# Altium schematic sheet RGBM-05.SchDoc
size Tabloid; SheetNumber: 5; SheetTotal: 7
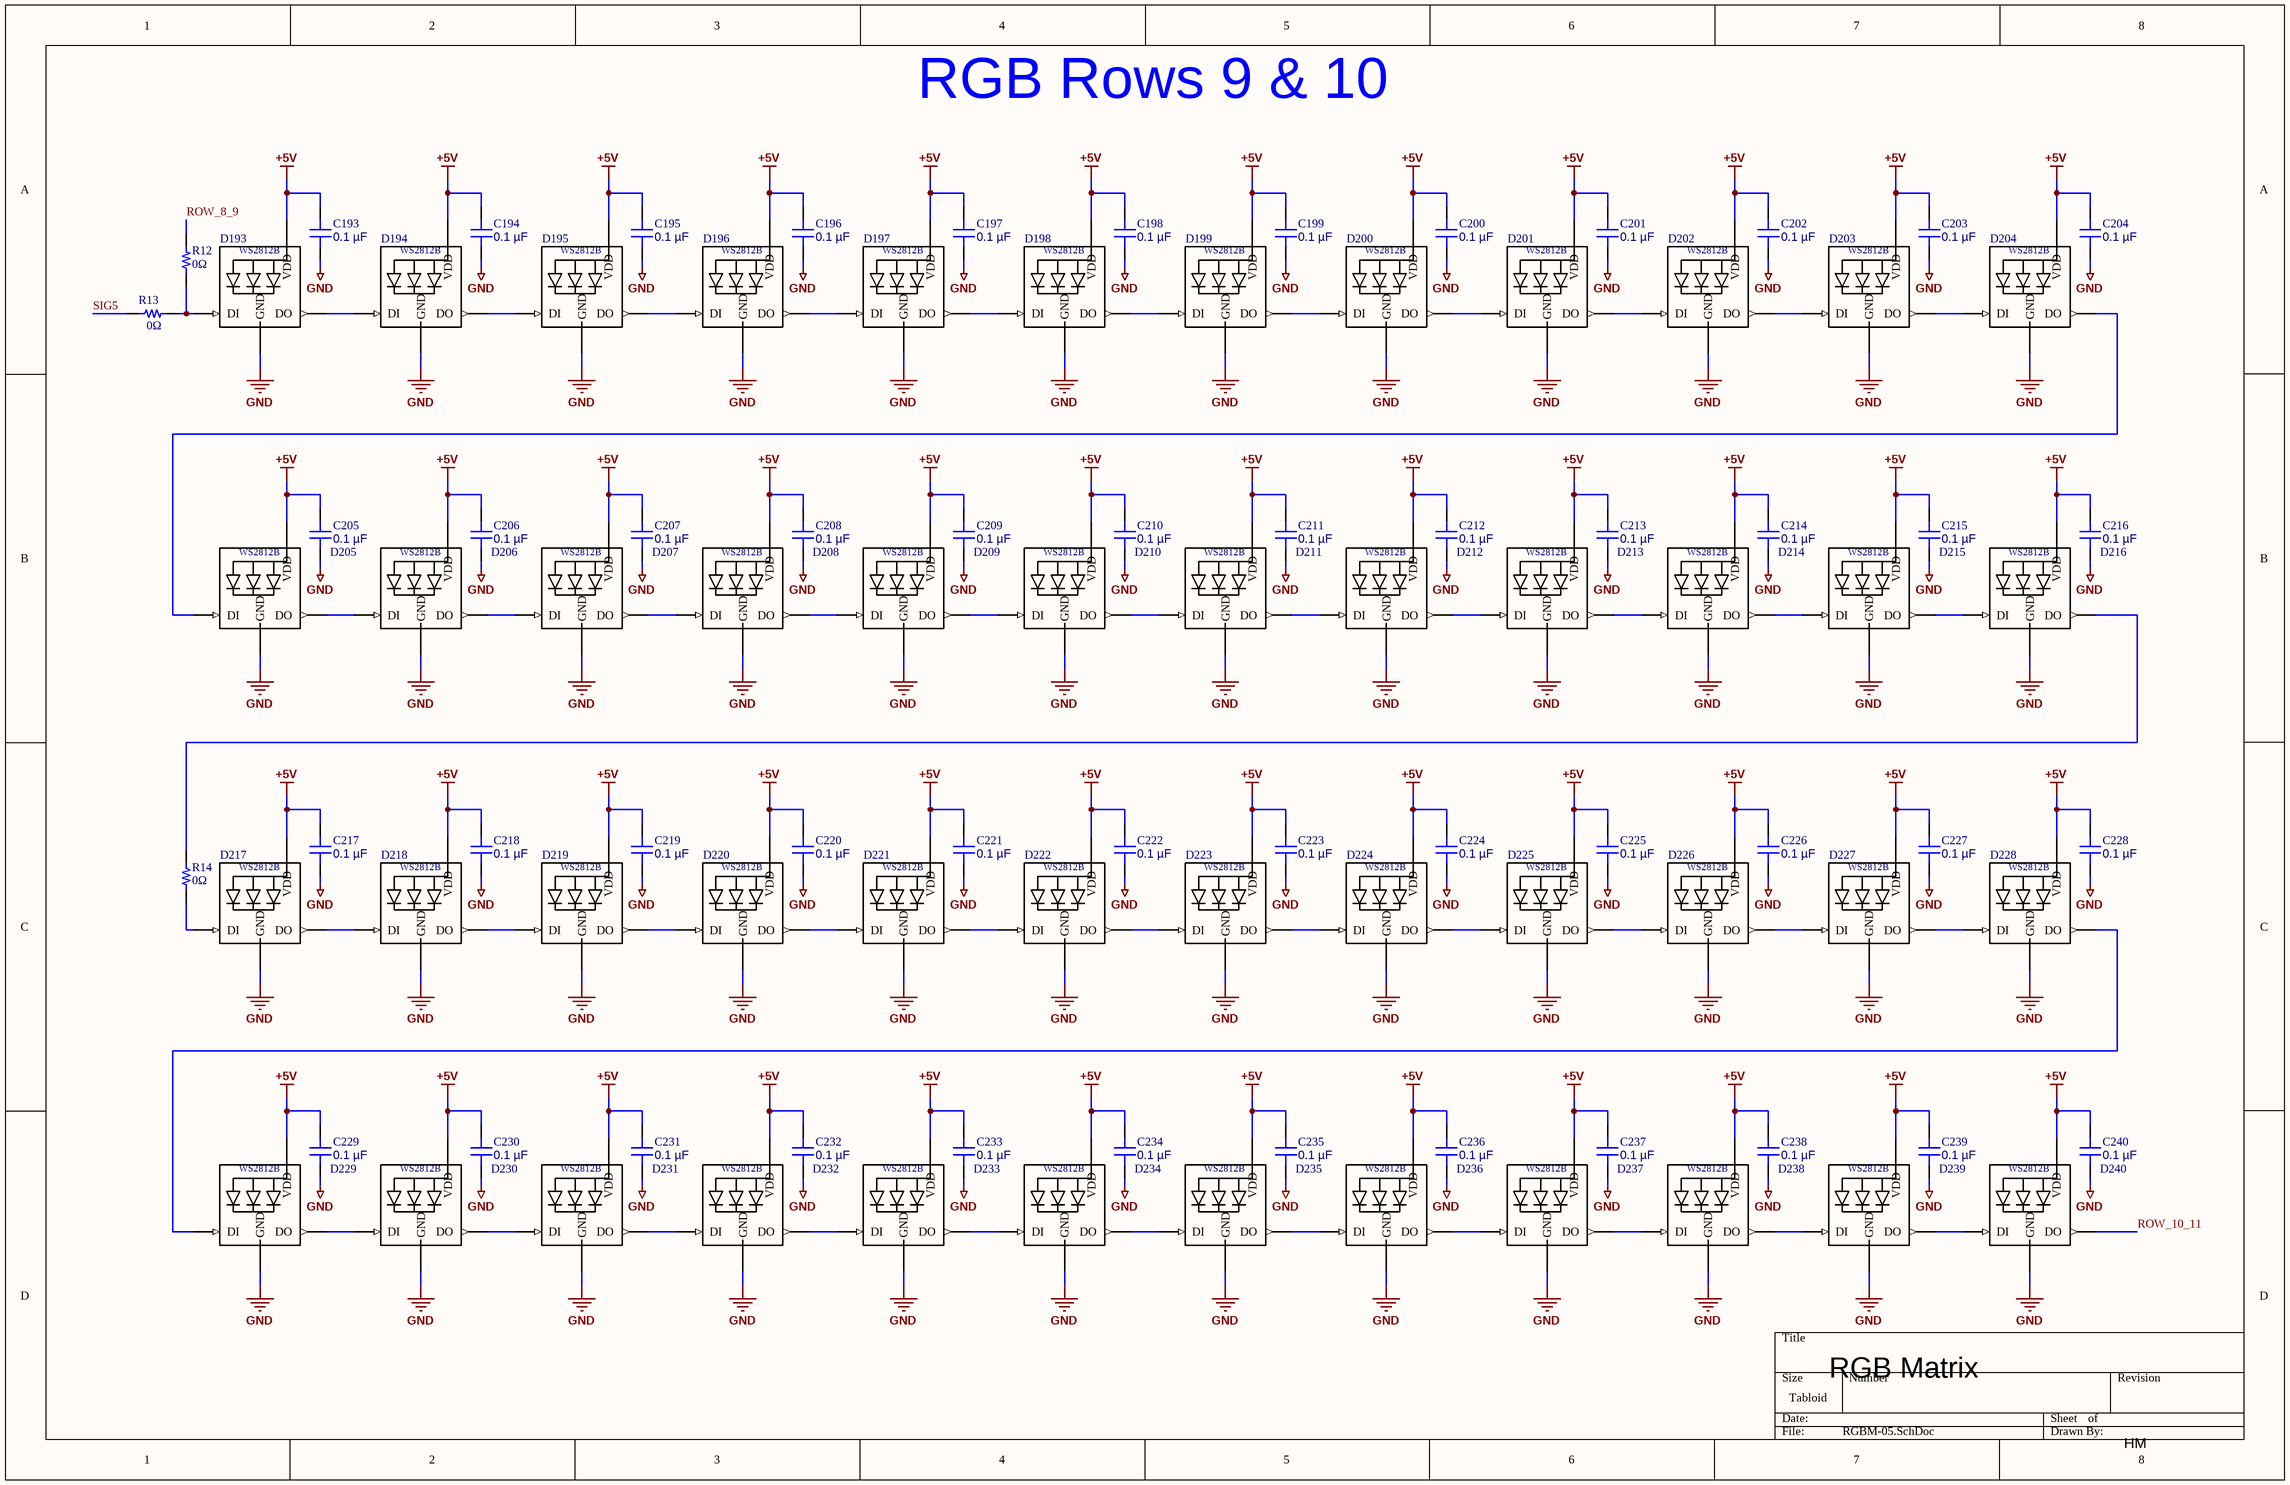
[diagram p0: RGBM-05.SchDoc]

## Parts
C193  0.1 µF  [CAP 0603_1608]
C194  0.1 µF  [CAP 0603_1608]
C195  0.1 µF  [CAP 0603_1608]
C196  0.1 µF  [CAP 0603_1608]
C197  0.1 µF  [CAP 0603_1608]
C198  0.1 µF  [CAP 0603_1608]
C199  0.1 µF  [CAP 0603_1608]
C200  0.1 µF  [CAP 0603_1608]
C201  0.1 µF  [CAP 0603_1608]
C202  0.1 µF  [CAP 0603_1608]
C203  0.1 µF  [CAP 0603_1608]
C204  0.1 µF  [CAP 0603_1608]
C205  0.1 µF  [CAP 0603_1608]
C206  0.1 µF  [CAP 0603_1608]
C207  0.1 µF  [CAP 0603_1608]
C208  0.1 µF  [CAP 0603_1608]
C209  0.1 µF  [CAP 0603_1608]
C210  0.1 µF  [CAP 0603_1608]
C211  0.1 µF  [CAP 0603_1608]
C212  0.1 µF  [CAP 0603_1608]
C213  0.1 µF  [CAP 0603_1608]
C214  0.1 µF  [CAP 0603_1608]
C215  0.1 µF  [CAP 0603_1608]
C216  0.1 µF  [CAP 0603_1608]
C217  0.1 µF  [CAP 0603_1608]
C218  0.1 µF  [CAP 0603_1608]
C219  0.1 µF  [CAP 0603_1608]
C220  0.1 µF  [CAP 0603_1608]
C221  0.1 µF  [CAP 0603_1608]
C222  0.1 µF  [CAP 0603_1608]
C223  0.1 µF  [CAP 0603_1608]
C224  0.1 µF  [CAP 0603_1608]
C225  0.1 µF  [CAP 0603_1608]
C226  0.1 µF  [CAP 0603_1608]
C227  0.1 µF  [CAP 0603_1608]
C228  0.1 µF  [CAP 0603_1608]
C229  0.1 µF  [CAP 0603_1608]
C230  0.1 µF  [CAP 0603_1608]
C231  0.1 µF  [CAP 0603_1608]
C232  0.1 µF  [CAP 0603_1608]
C233  0.1 µF  [CAP 0603_1608]
C234  0.1 µF  [CAP 0603_1608]
C235  0.1 µF  [CAP 0603_1608]
C236  0.1 µF  [CAP 0603_1608]
C237  0.1 µF  [CAP 0603_1608]
C238  0.1 µF  [CAP 0603_1608]
C239  0.1 µF  [CAP 0603_1608]
C240  0.1 µF  [CAP 0603_1608]
D193  WS2812B  [*WS2812B_WS2812B(Primary)]  (value not drawn)
D194  WS2812B  [*WS2812B_WS2812B(Primary)]  (value not drawn)
D195  WS2812B  [*WS2812B_WS2812B(Primary)]  (value not drawn)
D196  WS2812B  [*WS2812B_WS2812B(Primary)]  (value not drawn)
D197  WS2812B  [*WS2812B_WS2812B(Primary)]  (value not drawn)
D198  WS2812B  [*WS2812B_WS2812B(Primary)]  (value not drawn)
D199  WS2812B  [*WS2812B_WS2812B(Primary)]  (value not drawn)
D200  WS2812B  [*WS2812B_WS2812B(Primary)]  (value not drawn)
D201  WS2812B  [*WS2812B_WS2812B(Primary)]  (value not drawn)
D202  WS2812B  [*WS2812B_WS2812B(Primary)]  (value not drawn)
D203  WS2812B  [*WS2812B_WS2812B(Primary)]  (value not drawn)
D204  WS2812B  [*WS2812B_WS2812B(Primary)]  (value not drawn)
D205  WS2812B  [*WS2812B_WS2812B(Primary)]  (value not drawn)
D206  WS2812B  [*WS2812B_WS2812B(Primary)]  (value not drawn)
D207  WS2812B  [*WS2812B_WS2812B(Primary)]  (value not drawn)
D208  WS2812B  [*WS2812B_WS2812B(Primary)]  (value not drawn)
D209  WS2812B  [*WS2812B_WS2812B(Primary)]  (value not drawn)
D210  WS2812B  [*WS2812B_WS2812B(Primary)]  (value not drawn)
D211  WS2812B  [*WS2812B_WS2812B(Primary)]  (value not drawn)
D212  WS2812B  [*WS2812B_WS2812B(Primary)]  (value not drawn)
D213  WS2812B  [*WS2812B_WS2812B(Primary)]  (value not drawn)
D214  WS2812B  [*WS2812B_WS2812B(Primary)]  (value not drawn)
D215  WS2812B  [*WS2812B_WS2812B(Primary)]  (value not drawn)
D216  WS2812B  [*WS2812B_WS2812B(Primary)]  (value not drawn)
D217  WS2812B  [*WS2812B_WS2812B(Primary)]  (value not drawn)
D218  WS2812B  [*WS2812B_WS2812B(Primary)]  (value not drawn)
D219  WS2812B  [*WS2812B_WS2812B(Primary)]  (value not drawn)
D220  WS2812B  [*WS2812B_WS2812B(Primary)]  (value not drawn)
D221  WS2812B  [*WS2812B_WS2812B(Primary)]  (value not drawn)
D222  WS2812B  [*WS2812B_WS2812B(Primary)]  (value not drawn)
D223  WS2812B  [*WS2812B_WS2812B(Primary)]  (value not drawn)
D224  WS2812B  [*WS2812B_WS2812B(Primary)]  (value not drawn)
D225  WS2812B  [*WS2812B_WS2812B(Primary)]  (value not drawn)
D226  WS2812B  [*WS2812B_WS2812B(Primary)]  (value not drawn)
D227  WS2812B  [*WS2812B_WS2812B(Primary)]  (value not drawn)
D228  WS2812B  [*WS2812B_WS2812B(Primary)]  (value not drawn)
D229  WS2812B  [*WS2812B_WS2812B(Primary)]  (value not drawn)
D230  WS2812B  [*WS2812B_WS2812B(Primary)]  (value not drawn)
D231  WS2812B  [*WS2812B_WS2812B(Primary)]  (value not drawn)
D232  WS2812B  [*WS2812B_WS2812B(Primary)]  (value not drawn)
D233  WS2812B  [*WS2812B_WS2812B(Primary)]  (value not drawn)
D234  WS2812B  [*WS2812B_WS2812B(Primary)]  (value not drawn)
D235  WS2812B  [*WS2812B_WS2812B(Primary)]  (value not drawn)
D236  WS2812B  [*WS2812B_WS2812B(Primary)]  (value not drawn)
D237  WS2812B  [*WS2812B_WS2812B(Primary)]  (value not drawn)
D238  WS2812B  [*WS2812B_WS2812B(Primary)]  (value not drawn)
D239  WS2812B  [*WS2812B_WS2812B(Primary)]  (value not drawn)
D240  WS2812B  [*WS2812B_WS2812B(Primary)]  (value not drawn)
R12  0Ω  [RES 0603_1608]
R13  0Ω  [RES 0603_1608]
R14  0Ω  [RES 0603_1608]

## Nets
+5V: C193.2 C194.2 C195.2 C196.2 C197.2 C198.2 C199.2 C200.2 C201.2 C202.2 C203.2 C204.2 C205.2 C206.2 C207.2 C208.2 C209.2 C210.2 C211.2 C212.2 C213.2 C214.2 C215.2 C216.2 C217.2 C218.2 C219.2 C220.2 C221.2 C222.2 C223.2 C224.2 C225.2 C226.2 C227.2 C228.2 C229.2 C230.2 C231.2 C232.2 C233.2 C234.2 C235.2 C236.2 C237.2 C238.2 C239.2 C240.2 D193.1-VDD(VDD) D194.1-VDD(VDD) D195.1-VDD(VDD) D196.1-VDD(VDD) D197.1-VDD(VDD) D198.1-VDD(VDD) D199.1-VDD(VDD) D200.1-VDD(VDD) D201.1-VDD(VDD) D202.1-VDD(VDD) D203.1-VDD(VDD) D204.1-VDD(VDD) D205.1-VDD(VDD) D206.1-VDD(VDD) D207.1-VDD(VDD) D208.1-VDD(VDD) D209.1-VDD(VDD) D210.1-VDD(VDD) D211.1-VDD(VDD) D212.1-VDD(VDD) D213.1-VDD(VDD) D214.1-VDD(VDD) D215.1-VDD(VDD) D216.1-VDD(VDD) D217.1-VDD(VDD) D218.1-VDD(VDD) D219.1-VDD(VDD) D220.1-VDD(VDD) D221.1-VDD(VDD) D222.1-VDD(VDD) D223.1-VDD(VDD) D224.1-VDD(VDD) D225.1-VDD(VDD) D226.1-VDD(VDD) D227.1-VDD(VDD) D228.1-VDD(VDD) D229.1-VDD(VDD) D230.1-VDD(VDD) D231.1-VDD(VDD) D232.1-VDD(VDD) D233.1-VDD(VDD) D234.1-VDD(VDD) D235.1-VDD(VDD) D236.1-VDD(VDD) D237.1-VDD(VDD) D238.1-VDD(VDD) D239.1-VDD(VDD) D240.1-VDD(VDD)
GND: C193.1 C194.1 C195.1 C196.1 C197.1 C198.1 C199.1 C200.1 C201.1 C202.1 C203.1 C204.1 C205.1 C206.1 C207.1 C208.1 C209.1 C210.1 C211.1 C212.1 C213.1 C214.1 C215.1 C216.1 C217.1 C218.1 C219.1 C220.1 C221.1 C222.1 C223.1 C224.1 C225.1 C226.1 C227.1 C228.1 C229.1 C230.1 C231.1 C232.1 C233.1 C234.1 C235.1 C236.1 C237.1 C238.1 C239.1 C240.1 D193.3-GND(GND) D194.3-GND(GND) D195.3-GND(GND) D196.3-GND(GND) D197.3-GND(GND) D198.3-GND(GND) D199.3-GND(GND) D200.3-GND(GND) D201.3-GND(GND) D202.3-GND(GND) D203.3-GND(GND) D204.3-GND(GND) D205.3-GND(GND) D206.3-GND(GND) D207.3-GND(GND) D208.3-GND(GND) D209.3-GND(GND) D210.3-GND(GND) D211.3-GND(GND) D212.3-GND(GND) D213.3-GND(GND) D214.3-GND(GND) D215.3-GND(GND) D216.3-GND(GND) D217.3-GND(GND) D218.3-GND(GND) D219.3-GND(GND) D220.3-GND(GND) D221.3-GND(GND) D222.3-GND(GND) D223.3-GND(GND) D224.3-GND(GND) D225.3-GND(GND) D226.3-GND(GND) D227.3-GND(GND) D228.3-GND(GND) D229.3-GND(GND) D230.3-GND(GND) D231.3-GND(GND) D232.3-GND(GND) D233.3-GND(GND) D234.3-GND(GND) D235.3-GND(GND) D236.3-GND(GND) D237.3-GND(GND) D238.3-GND(GND) D239.3-GND(GND) D240.3-GND(GND)
ROW_8_9: R12.2
ROW_10_11: D240.2-DOUT(DO)
SIG5: R13.1
NetD193_2-DOUT: D193.2-DOUT(DO) D194.4-DIN(DI)
NetD193_4-DIN: D193.4-DIN(DI) R12.1 R13.2
NetD194_2-DOUT: D194.2-DOUT(DO) D195.4-DIN(DI)
NetD195_2-DOUT: D195.2-DOUT(DO) D196.4-DIN(DI)
NetD196_2-DOUT: D196.2-DOUT(DO) D197.4-DIN(DI)
NetD197_2-DOUT: D197.2-DOUT(DO) D198.4-DIN(DI)
NetD198_2-DOUT: D198.2-DOUT(DO) D199.4-DIN(DI)
NetD199_2-DOUT: D199.2-DOUT(DO) D200.4-DIN(DI)
NetD200_2-DOUT: D200.2-DOUT(DO) D201.4-DIN(DI)
NetD201_2-DOUT: D201.2-DOUT(DO) D202.4-DIN(DI)
NetD202_2-DOUT: D202.2-DOUT(DO) D203.4-DIN(DI)
NetD203_2-DOUT: D203.2-DOUT(DO) D204.4-DIN(DI)
NetD204_2-DOUT: D204.2-DOUT(DO) D205.4-DIN(DI)
NetD205_2-DOUT: D205.2-DOUT(DO) D206.4-DIN(DI)
NetD206_2-DOUT: D206.2-DOUT(DO) D207.4-DIN(DI)
NetD207_2-DOUT: D207.2-DOUT(DO) D208.4-DIN(DI)
NetD208_2-DOUT: D208.2-DOUT(DO) D209.4-DIN(DI)
NetD209_2-DOUT: D209.2-DOUT(DO) D210.4-DIN(DI)
NetD210_2-DOUT: D210.2-DOUT(DO) D211.4-DIN(DI)
NetD211_2-DOUT: D211.2-DOUT(DO) D212.4-DIN(DI)
NetD212_2-DOUT: D212.2-DOUT(DO) D213.4-DIN(DI)
NetD213_2-DOUT: D213.2-DOUT(DO) D214.4-DIN(DI)
NetD214_2-DOUT: D214.2-DOUT(DO) D215.4-DIN(DI)
NetD215_2-DOUT: D215.2-DOUT(DO) D216.4-DIN(DI)
NetD216_2-DOUT: D216.2-DOUT(DO) R14.2
NetD217_2-DOUT: D217.2-DOUT(DO) D218.4-DIN(DI)
NetD217_4-DIN: D217.4-DIN(DI) R14.1
NetD218_2-DOUT: D218.2-DOUT(DO) D219.4-DIN(DI)
NetD219_2-DOUT: D219.2-DOUT(DO) D220.4-DIN(DI)
NetD220_2-DOUT: D220.2-DOUT(DO) D221.4-DIN(DI)
NetD221_2-DOUT: D221.2-DOUT(DO) D222.4-DIN(DI)
NetD222_2-DOUT: D222.2-DOUT(DO) D223.4-DIN(DI)
NetD223_2-DOUT: D223.2-DOUT(DO) D224.4-DIN(DI)
NetD224_2-DOUT: D224.2-DOUT(DO) D225.4-DIN(DI)
NetD225_2-DOUT: D225.2-DOUT(DO) D226.4-DIN(DI)
NetD226_2-DOUT: D226.2-DOUT(DO) D227.4-DIN(DI)
NetD227_2-DOUT: D227.2-DOUT(DO) D228.4-DIN(DI)
NetD228_2-DOUT: D228.2-DOUT(DO) D229.4-DIN(DI)
NetD229_2-DOUT: D229.2-DOUT(DO) D230.4-DIN(DI)
NetD230_2-DOUT: D230.2-DOUT(DO) D231.4-DIN(DI)
NetD231_2-DOUT: D231.2-DOUT(DO) D232.4-DIN(DI)
NetD232_2-DOUT: D232.2-DOUT(DO) D233.4-DIN(DI)
NetD233_2-DOUT: D233.2-DOUT(DO) D234.4-DIN(DI)
NetD234_2-DOUT: D234.2-DOUT(DO) D235.4-DIN(DI)
NetD235_2-DOUT: D235.2-DOUT(DO) D236.4-DIN(DI)
NetD236_2-DOUT: D236.2-DOUT(DO) D237.4-DIN(DI)
NetD237_2-DOUT: D237.2-DOUT(DO) D238.4-DIN(DI)
NetD238_2-DOUT: D238.2-DOUT(DO) D239.4-DIN(DI)
NetD239_2-DOUT: D239.2-DOUT(DO) D240.4-DIN(DI)

## Notes on the sheet
- RGB Rows 9 & 10
- RGB Matrix
- HM

## Library data of the parts
C193-C240 = C0603C104K5RAC7411: CAP CER 0.1UF 50V X7R 0603; manufacturer: KEMET; Tolerance: ±10%; Part Number: C0603C104K5RAC7411; Capacitance: 0.1 µF; Applications: Bypass, Decoupling; componentlink1description: Datasheet; componentlink1url: https://api.kemet.com/component-edge/download/datasheet/C0603C104K5RAC7411.pdf; componentlink2description: DigiKey Link; componentlink2url: https://www.digikey.com/en/products/detail/kemet/C0603C104K5RAC7411/3317013; Device Package: 0603 (1608 Metric); lastupdated: 2026-04-06 7:23:52 PM; Lifecycle Status: Active; Minimum Order: 1; Mounting Type: Surface Mount, MLCC; Operating Temperature: -55°C ~ 125°C; Package / Case: 0603 (1608 Metric); packaging: TapeAndReel; partid: 2233; Part Status: Active; price: 0.01; series: SMD Comm X7R; Size / Dimension: 0.063" L x 0.031" W (1.60mm x 0.80mm); Supplier 1: DigiKey; Supplier Part Number 1: 399-C0603C104K5RAC7411CT-ND; Temperature Coefficient: X7R; Thickness (Max): 0.035" (0.90mm); value: 0.1 µF; Voltage - Rated: 50V
D193-D240 = WS2812B: Intelligent control LED integrated light source; MF: Worldsemi; SnapEDA_Link: https://www.snapeda.com/parts/WS2812B/Worldsemi/view-part/?ref=snap; Package: None; MP: WS2812B; Check_prices: https://www.snapeda.com/parts/WS2812B/Worldsemi/view-part/?ref=eda; Value: *
R12-R14 = YJP1608-R001: RES SMD 0 OHM JUMPER 0603; Manufacturer: Susumu; Value: 0 Ohms; Part Number: YJP1608-R001; ComponentLink1Description: Datasheet; ComponentLink1URL: http://www.susumu.co.jp/common/pdf/n_catalog_partition10_en.pdf; ComponentLink2Description: DigiKey Link; ComponentLink2URL: https://www.digikey.com/en/products/detail/susumu/YJP1608-R001/2815047; Composition: Thin Film; Device Package: 0603 (1608 Metric); Height - Seated (Max): 0.016" (0.40mm); LastUpdated: 2024-02-09 8:42:50 PM; Lifecycle Status: Active; Minimum Order: 1; Number of Terminations: 2; Operating Temperature: -40°C ~ 125°C; Package / Case: 0603 (1608 Metric); Packaging: TapeAndReel; PartId: 16802; Part Status: Active; Price: 0.08; Resistance: 0 Ohms; Series: YJP; Size / Dimension: 0.063" L x 0.031" W (1.60mm x 0.80mm); Supplier 1: DigiKey; Supplier Part Number 1: 408-1515-1-ND; Supplier Device Package: 0603; Tolerance: Jumper